# Altium schematic sheet LED_BUFFER.SchDoc
size B
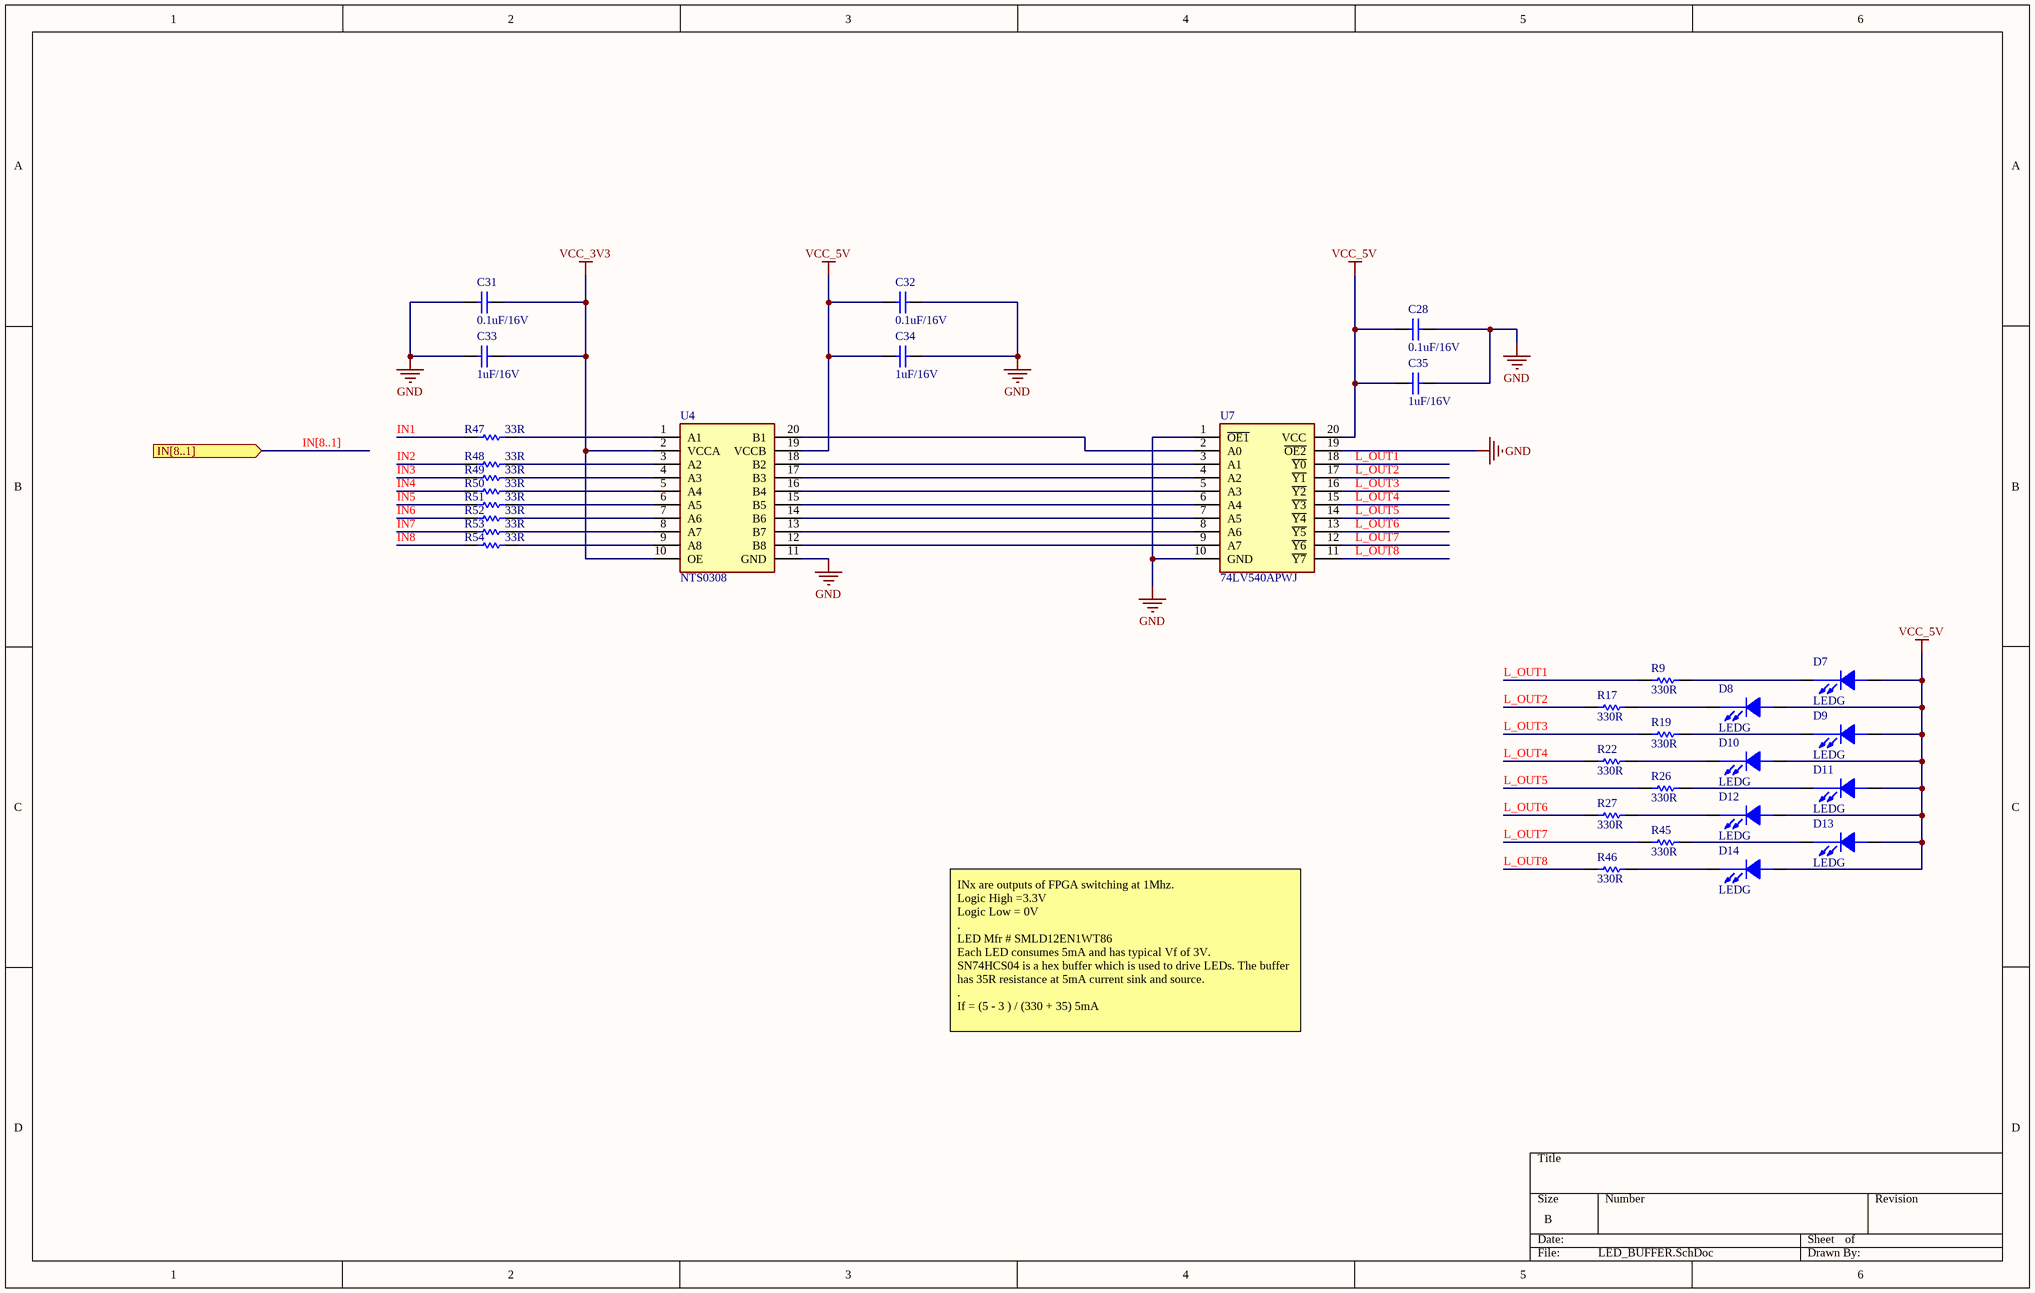
[diagram p0: LED_BUFFER.SchDoc]

## Parts
C28  0.1uF/16V  [0603C]
C31  0.1uF/16V  [0603C]
C32  0.1uF/16V  [0603C]
C33  1uF/16V  [0603C]
C34  1uF/16V  [0603C]
C35  1uF/16V  [0603C]
D7  LEDG  [LED_0603]
D8  LEDG  [LED_0603]
D9  LEDG  [LED_0603]
D10  LEDG  [LED_0603]
D11  LEDG  [LED_0603]
D12  LEDG  [LED_0603]
D13  LEDG  [LED_0603]
D14  LEDG  [LED_0603]
R9  330R  [0603R]
R17  330R  [0603R]
R19  330R  [0603R]
R22  330R  [0603R]
R26  330R  [0603R]
R27  330R  [0603R]
R45  330R  [0603R]
R46  330R  [0603R]
R47  33R  [0603R]
R48  33R  [0603R]
R49  33R  [0603R]
R50  33R  [0603R]
R51  33R  [0603R]
R52  33R  [0603R]
R53  33R  [0603R]
R54  33R  [0603R]
U4  NTS0308  [NTS0308EPWJ]
U7  74LV540APWJ  [SOP65P640X110-20N]

## Ports
IN[8..1] (in)

## Nets
GND: C28.2 C31.1 C32.2 C33.1 C34.2 C35.2 U4.11(GND) U7.1(~{OE1}) U7.10(GND) U7.19(~{OE2})
VCC_3V3: C31.2 C33.2 U4.2(VCCA) U4.10(OE)
VCC_5V: C28.1 C32.1 C34.1 C35.1 D7.1(ANODE) D8.1(ANODE) D9.1(ANODE) D10.1(ANODE) D11.1(ANODE) D12.1(ANODE) D13.1(ANODE) D14.1(ANODE) U4.19(VCCB) U7.20(VCC)
IN1: R47.2
IN2: R48.2
IN3: R49.2
IN4: R50.2
IN5: R51.2
IN6: R52.2
IN7: R53.2
IN8: R54.2
L_OUT1: R9.2 U7.18(~{Y0})
L_OUT2: R17.2 U7.17(~{Y1})
L_OUT3: R19.2 U7.16(~{Y2})
L_OUT4: R22.2 U7.15(~{Y3})
L_OUT5: R26.2 U7.14(~{Y4})
L_OUT6: R27.2 U7.13(~{Y5})
L_OUT7: R45.2 U7.12(~{Y6})
L_OUT8: R46.2 U7.11(~{Y7})
NetD7_2: D7.2(CATHODE) R9.1
NetD8_2: D8.2(CATHODE) R17.1
NetD9_2: D9.2(CATHODE) R19.1
NetD10_2: D10.2(CATHODE) R22.1
NetD11_2: D11.2(CATHODE) R26.1
NetD12_2: D12.2(CATHODE) R27.1
NetD13_2: D13.2(CATHODE) R45.1
NetD14_2: D14.2(CATHODE) R46.1
NetR47_1: R47.1 U4.1(A1)
NetR48_1: R48.1 U4.3(A2)
NetR49_1: R49.1 U4.4(A3)
NetR50_1: R50.1 U4.5(A4)
NetR51_1: R51.1 U4.6(A5)
NetR52_1: R52.1 U4.7(A6)
NetR53_1: R53.1 U4.8(A7)
NetR54_1: R54.1 U4.9(A8)
NetU4_12: U4.12(B8) U7.9(A7)
NetU4_13: U4.13(B7) U7.8(A6)
NetU4_14: U4.14(B6) U7.7(A5)
NetU4_15: U4.15(B5) U7.6(A4)
NetU4_16: U4.16(B4) U7.5(A3)
NetU4_17: U4.17(B3) U7.4(A2)
NetU4_18: U4.18(B2) U7.3(A1)
NetU4_20: U4.20(B1) U7.2(A0)

## Buses and harness runs
bus IN[8..1] = port IN[8..1]

## Notes on the sheet
- INx are outputs of FPGA switching at 1Mhz.
  Logic High =3.3V
  Logic Low = 0V
  .
  LED Mfr # SMLD12EN1WT86
  Each LED consumes 5mA and has typical Vf of 3V.
  SN74HCS04 is a hex buffer which is used to drive LEDs. The buffer has 35R resistance at 5mA current sink and source.
  .
  If = (5 - 3 ) / (330 + 35) 5mA

## Library data of the parts
C28 C31 C32 = Cap: Multilayer Ceramic Capacitors MLCC - SMD/SMT 0603 16VDC 0.1uF 10% X7R AEC-Q200; Mfr: Taiyo Yuden; Mfr Part No: EMK107B7104KAHT; Package: 0603; Price: 0.101; Stockiest: MOUSER; Stockiest Part No: 963-EMK107B7104KAHT; Value: 0.1uF/16V
C33-C35 = Cap: Multilayer Ceramic Capacitors MLCC - SMD/SMT 16volts 1uF X7R 10%; Mfr: KEMET; Mfr Part No: C0603C105K4RACTU; Package: 0603; Price: 0.101; Stockiest: MOUSER; Stockiest Part No: 80-C0603C105K4R; Value: 1uF/16V
D7-D14 = LED: Standard LEDs - SMD Grn 527nm; 140mcd 0603; 70mW; Mfr: ROHM Semiconductor; Mfr Part No: SMLD12EN1WT86; Value: GREEN; Package: 0603; Price: 0.695; Stockiest: MOUSER; Stockiest Part No: 755-SMLD12EN1WT86
R9 R17 R19 R22 R26 R27 R45 R46 = Res1: Thick Film Resistors - SMD 1/10Watt 330ohms 1% Commercial Use; Mfr: Vishay / Dale; Mfr Part No: CRCW0603330RFKEAC; Package: 0603; Price: 0.101; Stockiest: MOUSER; Stockiest Part No: 71-CRCW0603330RFKEAC; Value: 330R
R47-R54 = Res1: Thick Film Resistors - SMD 1/10Watt 33ohms 1% Commercial Use; Mfr: Vishay / Dale; Mfr Part No: CRCW060333R0FKEAC; Package: 0603; Price: 0.101; Stockiest: MOUSER; Stockiest Part No: 71-CRCW060333R0FKEAC; Value: 33R
U4 = TXS0108EPWR: Translation - Voltage Levels Dual supply translating transceiver; open drain; auto direction sensing; Mfr: NXP Semiconductors; Value: 8-BIT; Mfr Part No: NTS0308EPWJ; Price: 1.43; Stockiest: MOUSER; Stockiest Part No: 771-NTS0308EPWJ
U7 = 74LV540APWJ: Buffers & Line Drivers BUFFER LINE DRIVER; Mfr: Nexperia; Value: 16mA; Mfr Part No: 74LV540APWJ; Package: TSSOP-20; Price: 0.645; Stockiest: MOUSER; Stockiest Part No: 771-74LV540APWJ